# EAGLE design main_schematic (EAGLE 7.5.0)
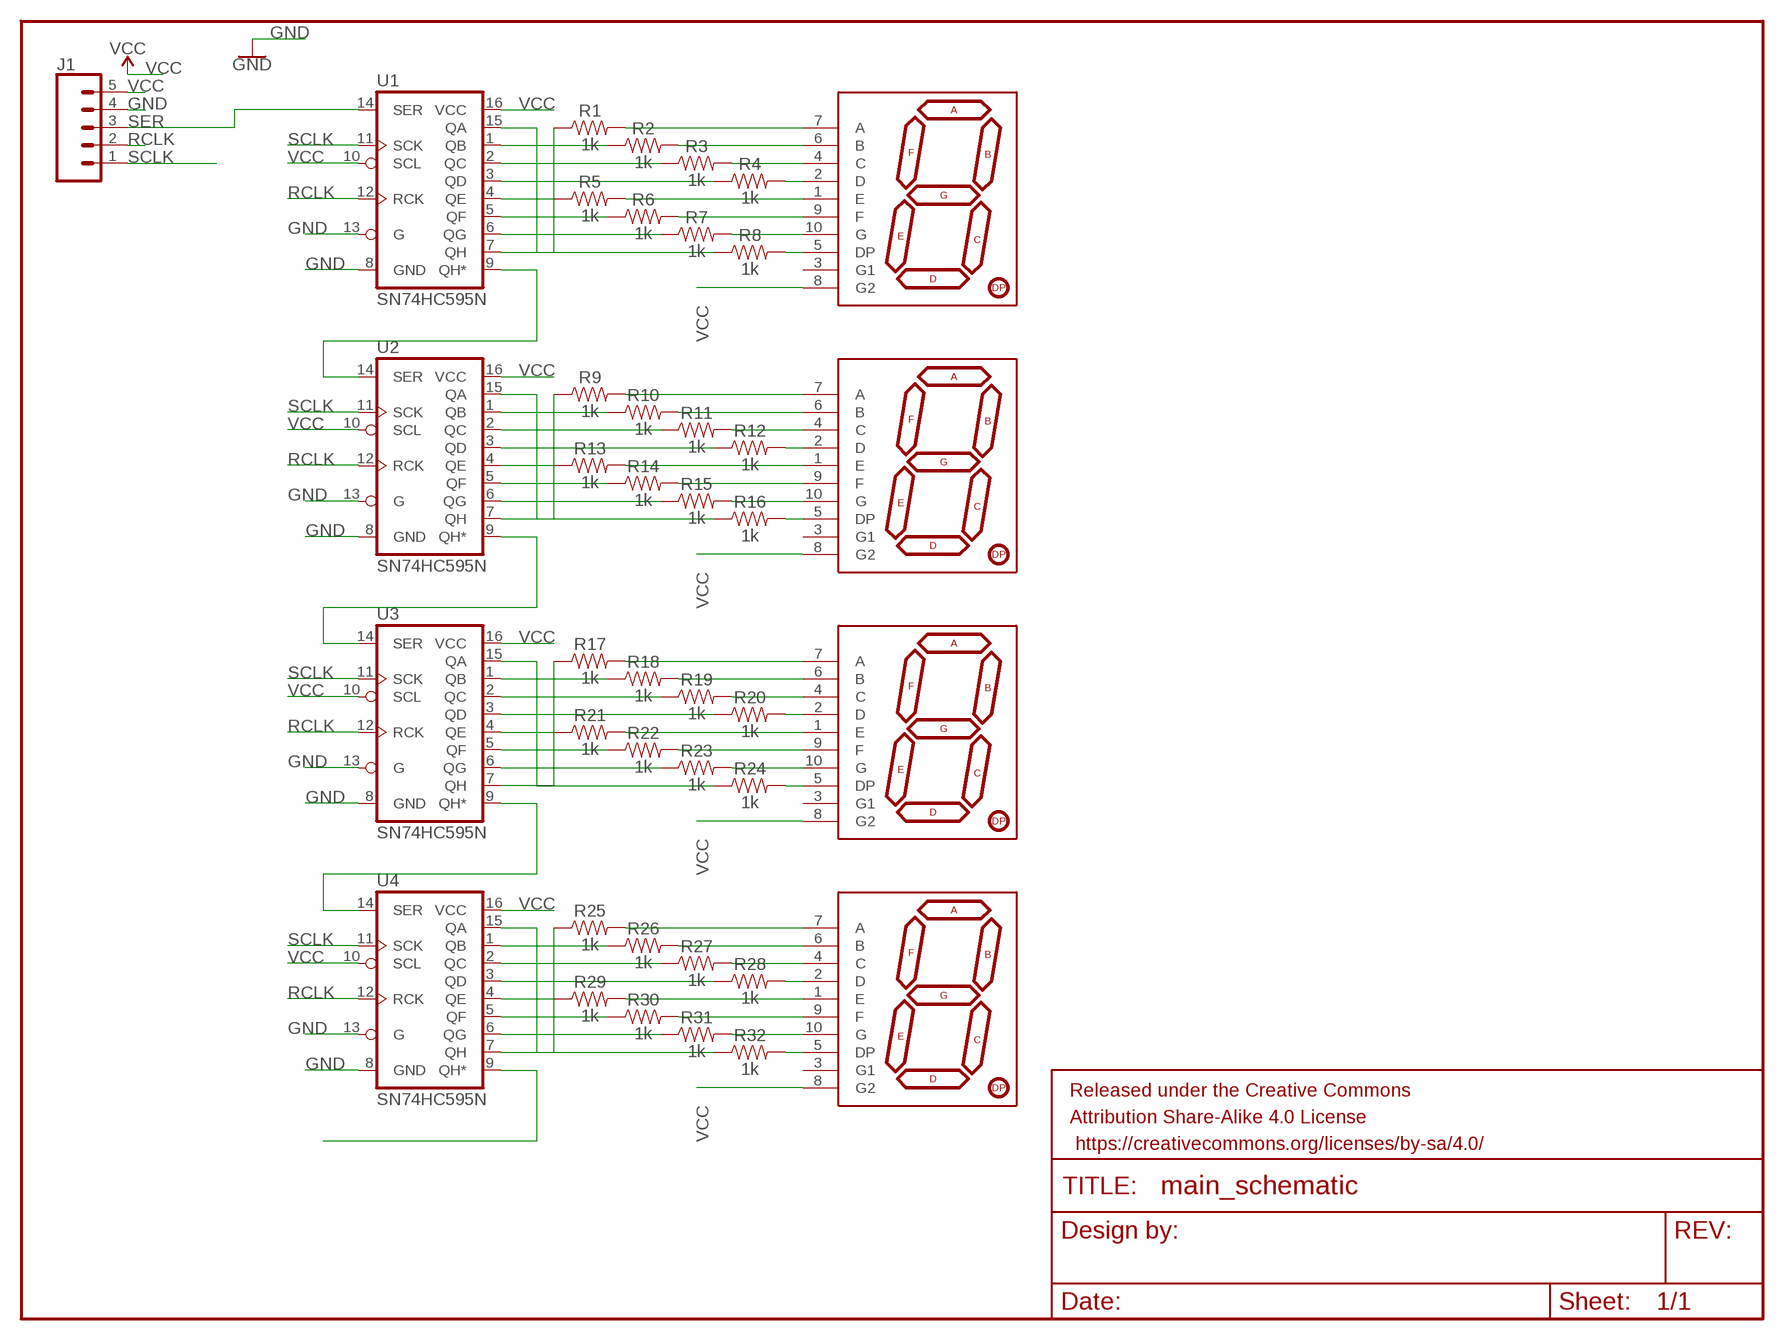
[diagram p0: schematic, sheet 1]

## Parts
FRAME1  FRAME-LETTER  [CREATIVE_COMMONS]
J1  CONN_05  [1X05]
R1  1k  1KOHM-HORIZ_KIT-1/4W-5%  [AXIAL-0.3-KIT]
R2  1k  1KOHM-HORIZ_KIT-1/4W-5%  [AXIAL-0.3-KIT]
R3  1k  1KOHM-HORIZ_KIT-1/4W-5%  [AXIAL-0.3-KIT]
R4  1k  1KOHM-HORIZ_KIT-1/4W-5%  [AXIAL-0.3-KIT]
R5  1k  1KOHM-HORIZ_KIT-1/4W-5%  [AXIAL-0.3-KIT]
R6  1k  1KOHM-HORIZ_KIT-1/4W-5%  [AXIAL-0.3-KIT]
R7  1k  1KOHM-HORIZ_KIT-1/4W-5%  [AXIAL-0.3-KIT]
R8  1k  1KOHM-HORIZ_KIT-1/4W-5%  [AXIAL-0.3-KIT]
R9  1k  1KOHM-HORIZ_KIT-1/4W-5%  [AXIAL-0.3-KIT]
R10  1k  1KOHM-HORIZ_KIT-1/4W-5%  [AXIAL-0.3-KIT]
R11  1k  1KOHM-HORIZ_KIT-1/4W-5%  [AXIAL-0.3-KIT]
R12  1k  1KOHM-HORIZ_KIT-1/4W-5%  [AXIAL-0.3-KIT]
R13  1k  1KOHM-HORIZ_KIT-1/4W-5%  [AXIAL-0.3-KIT]
R14  1k  1KOHM-HORIZ_KIT-1/4W-5%  [AXIAL-0.3-KIT]
R15  1k  1KOHM-HORIZ_KIT-1/4W-5%  [AXIAL-0.3-KIT]
R16  1k  1KOHM-HORIZ_KIT-1/4W-5%  [AXIAL-0.3-KIT]
R17  1k  1KOHM-HORIZ_KIT-1/4W-5%  [AXIAL-0.3-KIT]
R18  1k  1KOHM-HORIZ_KIT-1/4W-5%  [AXIAL-0.3-KIT]
R19  1k  1KOHM-HORIZ_KIT-1/4W-5%  [AXIAL-0.3-KIT]
R20  1k  1KOHM-HORIZ_KIT-1/4W-5%  [AXIAL-0.3-KIT]
R21  1k  1KOHM-HORIZ_KIT-1/4W-5%  [AXIAL-0.3-KIT]
R22  1k  1KOHM-HORIZ_KIT-1/4W-5%  [AXIAL-0.3-KIT]
R23  1k  1KOHM-HORIZ_KIT-1/4W-5%  [AXIAL-0.3-KIT]
R24  1k  1KOHM-HORIZ_KIT-1/4W-5%  [AXIAL-0.3-KIT]
R25  1k  1KOHM-HORIZ_KIT-1/4W-5%  [AXIAL-0.3-KIT]
R26  1k  1KOHM-HORIZ_KIT-1/4W-5%  [AXIAL-0.3-KIT]
R27  1k  1KOHM-HORIZ_KIT-1/4W-5%  [AXIAL-0.3-KIT]
R28  1k  1KOHM-HORIZ_KIT-1/4W-5%  [AXIAL-0.3-KIT]
R29  1k  1KOHM-HORIZ_KIT-1/4W-5%  [AXIAL-0.3-KIT]
R30  1k  1KOHM-HORIZ_KIT-1/4W-5%  [AXIAL-0.3-KIT]
R31  1k  1KOHM-HORIZ_KIT-1/4W-5%  [AXIAL-0.3-KIT]
R32  1k  1KOHM-HORIZ_KIT-1/4W-5%  [AXIAL-0.3-KIT]
U1  SN74HC595N  74HC595N  [DIP16]
U2  SN74HC595N  74HC595N  [DIP16]
U3  SN74HC595N  74HC595N  [DIP16]
U4  SN74HC595N  74HC595N  [DIP16]
U$1  YSD-160AB3C-8  7-SEGMENT-1DIGIT-1INCH-BLUE-EZ  [7-SEGMENT-1"PTH-EZ]
U$2  YSD-160AB3C-8  7-SEGMENT-1DIGIT-1INCH-BLUE-EZ  [7-SEGMENT-1"PTH-EZ]
U$3  YSD-160AB3C-8  7-SEGMENT-1DIGIT-1INCH-BLUE-EZ  [7-SEGMENT-1"PTH-EZ]
U$4  YSD-160AB3C-8  7-SEGMENT-1DIGIT-1INCH-BLUE-EZ  [7-SEGMENT-1"PTH-EZ]

## Nets
GND: J1.4 U1.8(GND) U1.13(G) U2.8(GND) U2.13(G) U3.8(GND) U3.13(G) U4.8(GND) U4.13(G)
N$1: R7.P$1 U1.6(QG)
N$2: R2.P$1 U1.1(QB)
N$3: R8.P$2 U$1.5(DP)
N$4: R3.P$1 U1.2(QC)
N$5: R4.P$1 U1.3(QD)
N$6: R7.P$2 U$1.10(G)
N$7: R6.P$2 U$1.9(F)
N$8: R5.P$2 U$1.1(E)
N$9: R4.P$2 U$1.2(D)
N$10: R3.P$2 U$1.4(C)
N$11: R2.P$2 U$1.6(B)
N$12: R1.P$2 U$1.7(A)
N$13: R5.P$1 U1.4(QE)
N$14: R6.P$1 U1.5(QF)
N$15: R8.P$1 U1.15(QA)
N$16: R1.P$1 U1.7(QH)
N$17: U1.9(QH*) U2.14(SER)
N$18: R16.P$2 U$2.5(DP)
N$19: R15.P$2 U$2.10(G)
N$20: R14.P$2 U$2.9(F)
N$21: R13.P$2 U$2.1(E)
N$22: R12.P$2 U$2.2(D)
N$23: R11.P$2 U$2.4(C)
N$24: R10.P$2 U$2.6(B)
N$25: U2.9(QH*) U3.14(SER)
N$26: R9.P$2 U$2.7(A)
N$27: R10.P$1 U2.1(QB)
N$28: R11.P$1 U2.2(QC)
N$29: R12.P$1 U2.3(QD)
N$30: R13.P$1 U2.4(QE)
N$31: R14.P$1 U2.5(QF)
N$32: R15.P$1 U2.6(QG)
N$33: R9.P$1 U2.7(QH)
N$34: R16.P$1 U2.15(QA)
N$35: R24.P$2 U$3.5(DP)
N$36: R23.P$2 U$3.10(G)
N$37: R22.P$2 U$3.9(F)
N$38: R21.P$2 U$3.1(E)
N$39: R20.P$2 U$3.2(D)
N$40: R19.P$2 U$3.4(C)
N$41: R18.P$2 U$3.6(B)
N$42: U3.9(QH*) U4.14(SER)
N$43: R17.P$2 U$3.7(A)
N$44: R18.P$1 U3.1(QB)
N$45: R19.P$1 U3.2(QC)
N$46: R20.P$1 U3.3(QD)
N$47: R21.P$1 U3.4(QE)
N$48: R22.P$1 U3.5(QF)
N$49: R23.P$1 U3.6(QG)
N$50: R17.P$1 U3.7(QH)
N$51: R24.P$1 U3.15(QA)
N$52: R32.P$2 U$4.5(DP)
N$53: R31.P$2 U$4.10(G)
N$54: R30.P$2 U$4.9(F)
N$55: R29.P$2 U$4.1(E)
N$56: R28.P$2 U$4.2(D)
N$57: R27.P$2 U$4.4(C)
N$58: R26.P$2 U$4.6(B)
N$59: U4.9(QH*)
N$60: R25.P$2 U$4.7(A)
N$61: R26.P$1 U4.1(QB)
N$62: R27.P$1 U4.2(QC)
N$63: R28.P$1 U4.3(QD)
N$64: R29.P$1 U4.4(QE)
N$65: R30.P$1 U4.5(QF)
N$66: R31.P$1 U4.6(QG)
N$67: R25.P$1 U4.7(QH)
N$68: R32.P$1 U4.15(QA)
RCLK: J1.2 U1.12(RCK) U2.12(RCK) U3.12(RCK) U4.12(RCK)
SCLK [via]: J1.1 U1.11(SCK) U2.11(SCK) U3.11(SCK) U4.11(SCK)
SER: J1.3 U1.14(SER)
VCC: J1.5 U1.10(SCL) U1.16(VCC) U2.10(SCL) U2.16(VCC) U3.10(SCL) U3.16(VCC) U4.10(SCL) U4.16(VCC) U$1.8(G2) U$2.8(G2) U$3.8(G2) U$4.8(G2)
Unconnected: U$1.3(G1) U$2.3(G1) U$3.3(G1) U$4.3(G1)

## Library data of the parts
FRAME1 = SparkFun-Aesthetics:FRAME-LETTER: Schematic Frame - Letter Standard 8.5x11 US Letter frame
J1 = SparkFun-Connectors:CONN_05: Multi connection point. Often used as Generic Header-pin footprint for 0.1 inch spaced/style header connections On any of the 0.1 inch spaced packages, you can populate with these: Break Away Headers - Straight <https://www.sparkfun.com/products/116> (PRT-00116) Break Away Male Headers - Right Angle <https://www.sparkfun.com/products/553> (PRT-00553) Female Headers <https://www.sparkfun.com/products/115> (PRT-00115) Break Away Headers - Machine Pin <https://www.sparkfun.com/products/117> (PRT-00117) Break Away Female Headers - Swiss Machine Pin <https://www.sparkfun.com/products/743> (PRT-00743) For SCREWTERMINALS and SPRING TERMINALS visit here: Screw Terimnals on SparkFun.com <https://www.sparkfun.com/search/results?term=Screw+Terminals> (5mm/3.5mm/2.54mm spacing) This device is also useful as a general connection point to wire up your design to another part of your project. Our various solder wires solder well into these plated through hole pads. Hook-Up Wire - Assortment (Stranded, 22 AWG) <https://www.sparkfun.com/products/11375> (PRT-11375) Hook-Up Wire - Assortment (Solid Core, 22 AWG) <https://www.sparkfun.com/products/11367> (PRT-11367) View the entire wire category on our website here <https://www.sparkfun.com/categories/141> Special notes: Molex polarized connector foot print use with SKU : PRT-08231 with associated crimp pins and housings. 1MM SMD Version SKU: PRT-10208
R1-R32 = SparkFun-Resistors:1KOHM: 1kΩ resistor A resistor is a passive two-terminal electrical component that implements electrical resistance as a circuit element. Resistors act to reduce current flow, and, at the same time, act to lower voltage levels within circuits. - Wikipedia; PROD_ID: RES-08380
U1-U4 = SparkFun-IC-Logic:74*595: 8-Bit Shift Register (Serial to Parallel) Datasheet <http://cdn.sparkfun.com/datasheets/BreakoutBoards/MM74HC595.pdf> SparkFun Products SparkFun Shift Register Breakout - 74HC595 <https://www.sparkfun.com/products/10680> (BOB-10680); PROD_ID: IC-13123
U$1-U$4 = SparkFun-LED:7-SEGMENT-1DIGIT-1INCH: 7-Segment Display, single digit, 1" EZ is for kits. Pads are only exposed on the bottom side to help prevent soldering in upside down. Datasheet (Red) <https://cdn.sparkfun.com/datasheets/Components/LED/YSD-160AR4B-8.pdf> Datasheet (Blue) <https://cdn.sparkfun.com/datasheets/Components/LED/YSD-160AB3C-8.pdf> SparkFun Products 7-Segment Display - LED (Red) <https://www.sparkfun.com/products/8546> (COM-08546) 7-Segment Display - LED (Blue) <https://www.sparkfun.com/products/9191> (COM-09191); PROD_ID: COMP-09495

## Net classes
1 via: width 0.025 mm, drill 0.508 mm, clearance 0.025 mm

## Board
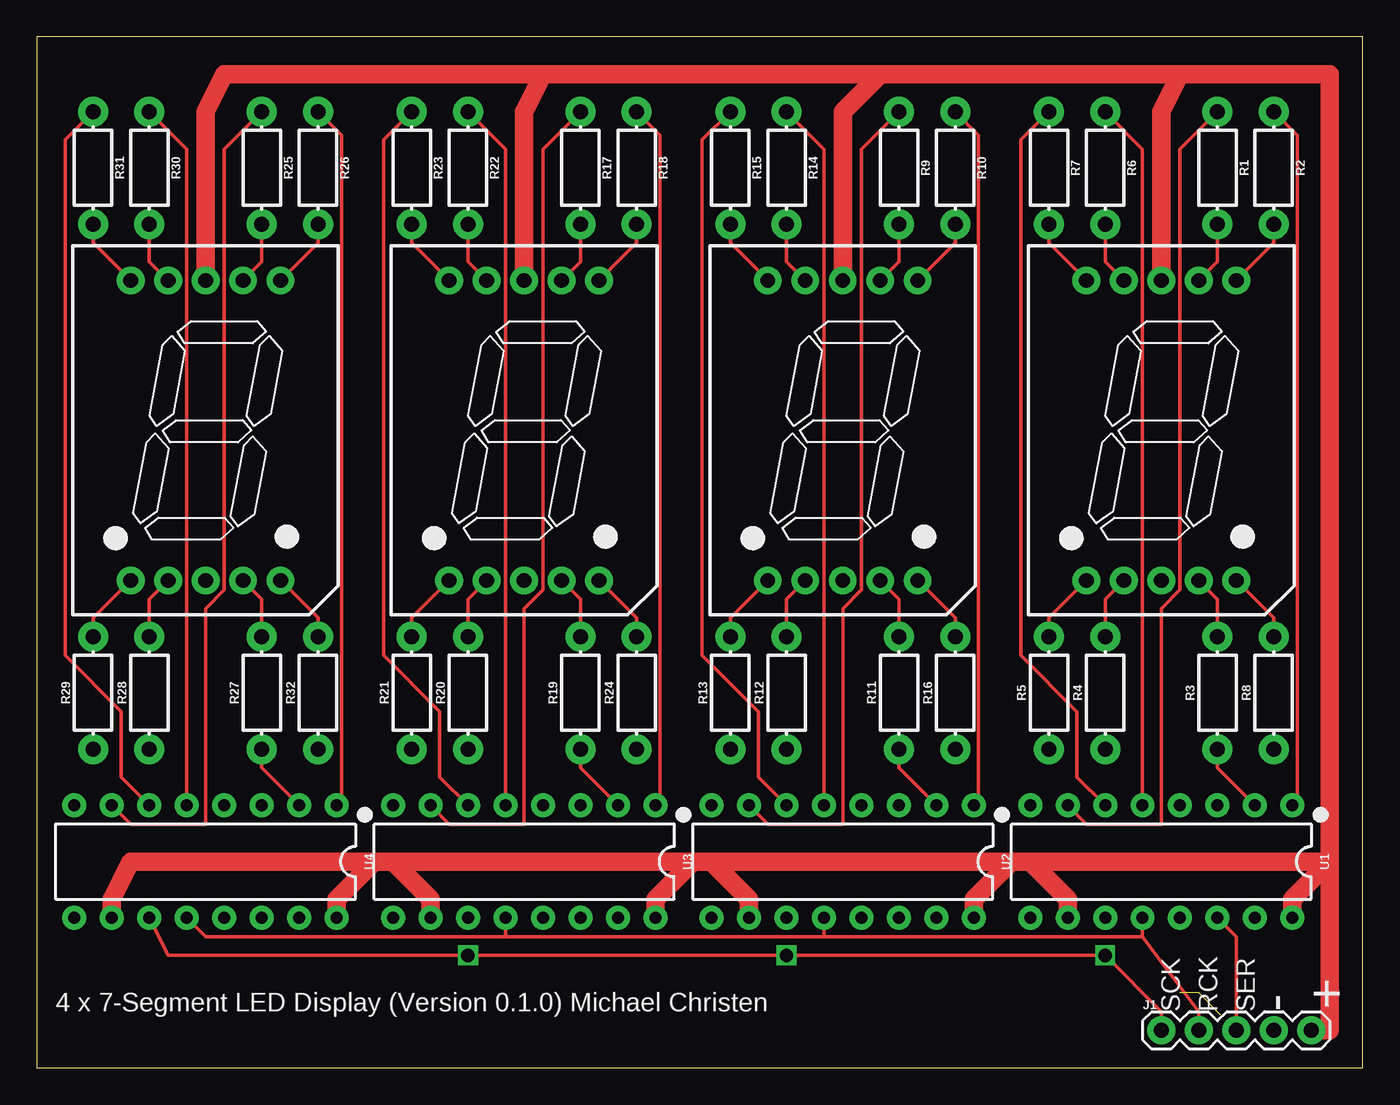
[diagram p1: board, top side]
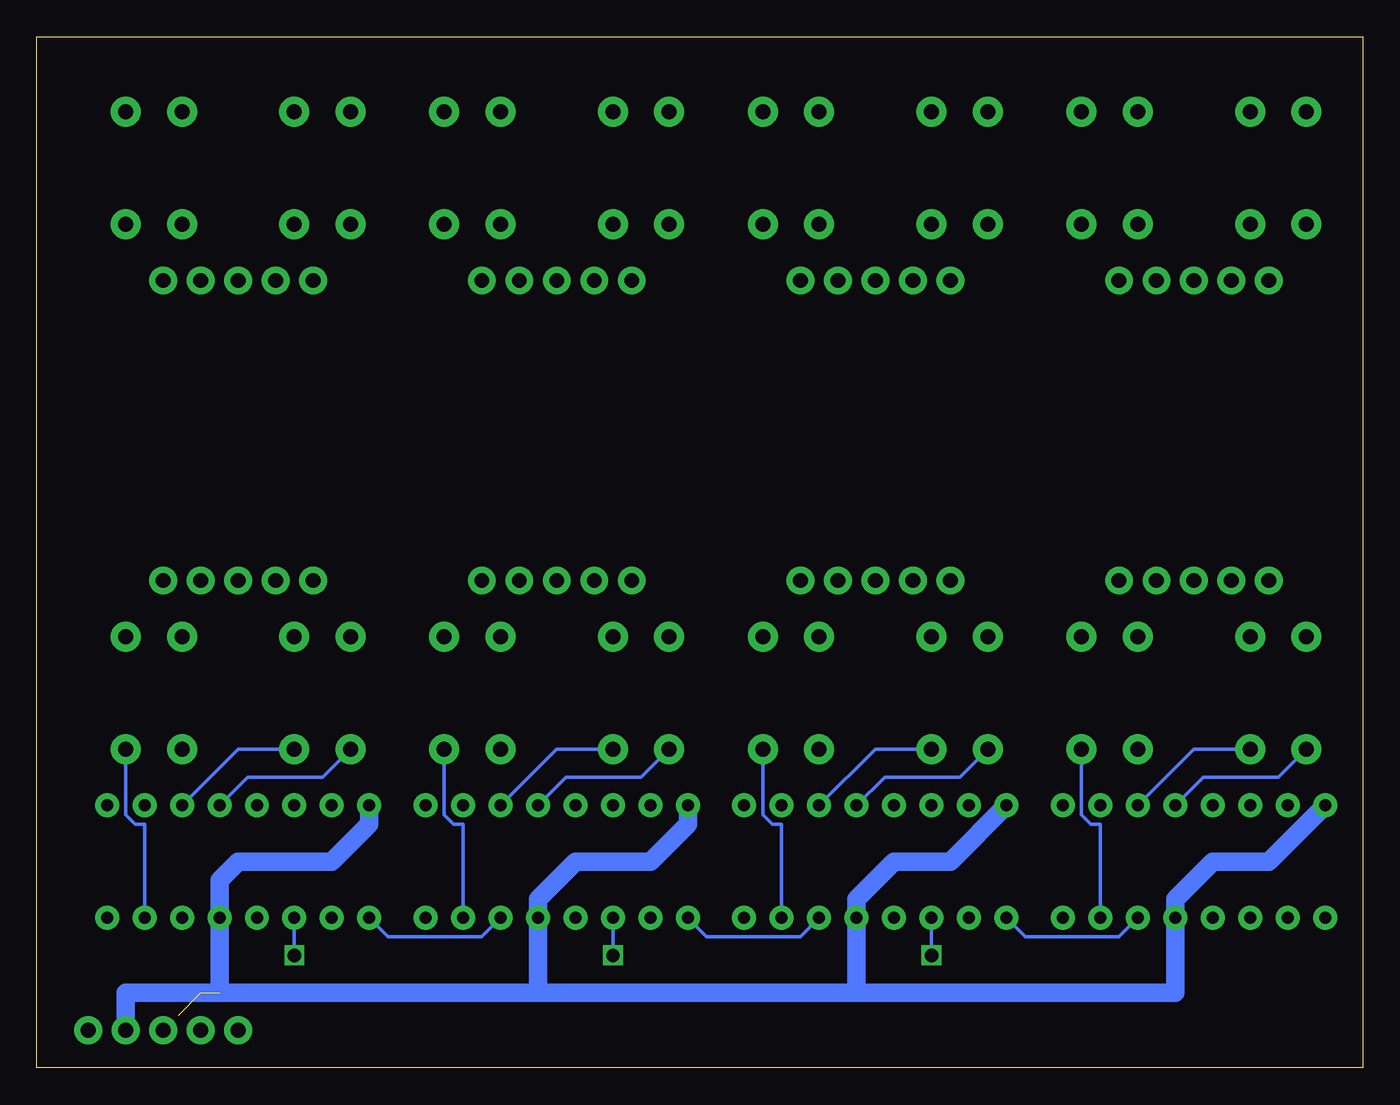
[diagram p2: board, bottom side, seen from below]

Size 89.84 x 69.84 mm. Coordinates in mm from the lower left corner, seen from the top.
Outline: 0,0 89.84,0 89.84,69.84 0,69.84 0,0
Copper layers (1*16): Top 0.035mm / dielectric 1.5mm / Bottom 0.035mm
Design rules "default": minimum track width 10mil, minimum drill 24mil, track to track 8mil, track to pad 8mil, pad to pad 8mil, via to via 8mil, smd to smd 8mil, copper to edge 40mil, drill to drill 8mil, minimum pad ring 10mil, minimum via ring 8mil, stop-mask expansion 4mil, vias tented up to drill 0mil, thermal gap 10mil

### Footprints (pad centres in the part's own frame; a part is rotated, then mirrored left to right if it is on the bottom)
1X05 = drill 1.016 pad 1.88: 1 0,0; 2 2.54,0; 3 5.08,0; 4 7.62,0; 5 10.16,0
AXIAL-0.3-KIT = drill 1.016 pad 2.032: P$1 -3.81,0; P$2 3.81,0
DIP16 = drill 0.813 pad 1.626: 1 -8.89,-3.81; 2 -6.35,-3.81; 3 -3.81,-3.81; 4 -1.27,-3.81; 5 1.27,-3.81; 6 3.81,-3.81; 7 6.35,-3.81; 8 8.89,-3.81; 9 8.89,3.81; 10 6.35,3.81; 11 3.81,3.81; 12 1.27,3.81; 13 -1.27,3.81; 14 -3.81,3.81; 15 -6.35,3.81; 16 -8.89,3.81
7-SEGMENT-1"PTH-EZ = drill 1 pad 1.88: 1 -5.08,-10.16; 2 -2.54,-10.16; 3 0,-10.16; 4 2.54,-10.16; 5 5.08,-10.16; 6 5.08,10.16; 7 2.54,10.16; 8 0,10.16; 9 -2.54,10.16; 10 -5.08,10.16

### Placement (x,y rotation side)
FRAME1  -111.76,-2.54 0 top  (outside the outline)
J1  76.2,2.54 0 top
R1  80.01,60.96 270 top
R2  83.82,60.96 270 top
R3  80.01,25.4 90 top
R4  72.39,25.4 90 top
R5  68.58,25.4 90 top
R6  72.39,60.96 270 top
R7  68.58,60.96 270 top
R8  83.82,25.4 90 top
R9  58.42,60.96 270 top
R10  62.23,60.96 270 top
R11  58.42,25.4 90 top
R12  50.8,25.4 90 top
R13  46.99,25.4 90 top
R14  50.8,60.96 270 top
R15  46.99,60.96 270 top
R16  62.23,25.4 90 top
R17  36.83,60.96 270 top
R18  40.64,60.96 270 top
R19  36.83,25.4 90 top
R20  29.21,25.4 90 top
R21  25.4,25.4 90 top
R22  29.21,60.96 270 top
R23  25.4,60.96 270 top
R24  40.64,25.4 90 top
R25  15.24,60.96 270 top
R26  19.05,60.96 270 top
R27  15.24,25.4 90 top
R28  7.62,25.4 90 top
R29  3.81,25.4 90 top
R30  7.62,60.96 270 top
R31  3.81,60.96 270 top
R32  19.05,25.4 90 top
U1  76.2,13.97 180 top
U2  54.61,13.97 180 top
U3  33.02,13.97 180 top
U4  11.43,13.97 180 top
U$1  76.2,43.18 0 top
U$2  54.61,43.18 0 top
U$3  33.02,43.18 0 top
U$4  11.43,43.18 0 top

### Tracks (layer width: path | path; a pad name or v marks a point on that pad's centre or on a via)
GND  (2 unrouted)
  Bottom 1.27: 77.47,5.08 83.82,5.08 J1.4 | 77.47,5.08 55.88,5.08 | 55.88,5.08 34.29,5.08 | 34.29,5.08 12.7,5.08 U4.13 12.7,11.43 10.16,13.97 6.35,13.97 U4.8 | 34.29,5.08 U3.13 34.29,11.43 31.75,13.97 27.94,13.97 U3.8 | 55.88,5.08 U2.13 55.88,11.43 53.34,13.97 48.26,13.97 45.72,16.51 U2.8 | U1.8 67.31,16.51 69.85,13.97 76.2,13.97 77.47,12.7 U1.13 77.47,5.08
N$1
  Top 0.254: U1.6 70.48,19.68 70.48,24.13 66.67,27.94 66.67,62.87 R7.P$1
N$2
  Top 0.254: U1.1 85.41,18.1 85.41,63.18 R2.P$1
N$3
  Top 0.254: U$1.5 83.82,30.48 R8.P$2
N$4
  Top 0.254: U1.2 80.01,20.32 R3.P$1
N$5
  Bottom 0.254: U1.3 76.2,21.59 R4.P$1
N$6
  Top 0.254: U$1.10 68.58,55.88 R7.P$2
N$7
  Top 0.254: U$1.9 72.39,54.61 R6.P$2
N$8
  Top 0.254: U$1.1 68.58,30.48 R5.P$2
N$9
  Top 0.254: U$1.2 72.39,31.75 R4.P$2
N$10
  Top 0.254: U$1.4 80.01,31.75 R3.P$2
N$11
  Top 0.254: U$1.6 83.82,55.88 R2.P$2
N$12
  Top 0.254: U$1.7 80.01,54.61 R1.P$2
N$13
  Bottom 0.254: U1.4 75.56,19.68 70.48,19.68 R5.P$1
N$14
  Top 0.254: U1.5 74.93,62.23 R6.P$1
N$15
  Bottom 0.254: U1.15 82.55,16.51 83.19,16.51 83.82,17.14 R8.P$1
N$16
  Top 0.254: U1.7 71.12,16.51 76.2,16.51 76.2,31.11 77.47,32.38 77.47,62.23 R1.P$1
N$17
  Bottom 0.254: U1.9 66.04,8.89 59.69,8.89 U2.14
N$18
  Top 0.254: U$2.5 62.23,30.48 R16.P$2
N$19
  Top 0.254: U$2.10 46.99,55.88 R15.P$2
N$20
  Top 0.254: U$2.9 50.8,54.61 R14.P$2
N$21
  Top 0.254: U$2.1 46.99,30.48 R13.P$2
N$22
  Top 0.254: U$2.2 50.8,31.75 R12.P$2
N$23
  Top 0.254: U$2.4 58.42,31.75 R11.P$2
N$24
  Top 0.254: U$2.6 62.23,55.88 R10.P$2
N$25
  Bottom 0.254: U2.9 44.45,8.89 38.1,8.89 U3.14
N$26
  Top 0.254: U$2.7 58.42,54.61 R9.P$2
N$27
  Top 0.254: U2.1 63.82,18.1 63.82,63.18 R10.P$1
N$28
  Top 0.254: U2.2 58.42,20.32 R11.P$1
N$29
  Bottom 0.254: U2.3 54.61,21.59 R12.P$1
N$30
  Bottom 0.254: U2.4 53.98,19.68 48.9,19.68 R13.P$1
N$31
  Top 0.254: U2.5 53.34,62.23 R14.P$1
N$32
  Top 0.254: U2.6 48.9,19.68 48.9,24.13 45.09,27.94 45.09,62.87 R15.P$1
N$33
  Top 0.254: U2.7 49.53,16.51 54.61,16.51 54.61,31.11 55.88,32.38 55.88,62.23 R9.P$1
N$34
  Bottom 0.254: U2.15 60.96,16.51 61.59,16.51 62.23,17.14 R16.P$1
N$35
  Top 0.254: U$3.5 40.64,30.48 R24.P$2
N$36
  Top 0.254: U$3.10 25.4,55.88 R23.P$2
N$37
  Top 0.254: U$3.9 29.21,54.61 R22.P$2
N$38
  Top 0.254: U$3.1 25.4,30.48 R21.P$2
N$39
  Top 0.254: U$3.2 29.21,31.75 R20.P$2
N$40
  Top 0.254: U$3.4 36.83,31.75 R19.P$2
N$41
  Top 0.254: U$3.6 40.64,55.88 R18.P$2
N$42
  Bottom 0.254: U3.9 22.86,8.89 16.51,8.89 U4.14
N$43
  Top 0.254: U$3.7 36.83,54.61 R17.P$2
N$44
  Top 0.254: U3.1 42.23,18.1 42.23,63.18 R18.P$1
N$45
  Top 0.254: U3.2 36.83,20.32 R19.P$1
N$46
  Bottom 0.254: U3.3 33.02,21.59 R20.P$1
N$47
  Bottom 0.254: U3.4 32.38,19.68 27.3,19.68 R21.P$1
N$48
  Top 0.254: U3.5 31.75,62.23 R22.P$1
N$49
  Top 0.254: U3.6 27.3,19.68 27.3,24.13 23.5,27.94 23.5,62.87 R23.P$1
N$50
  Top 0.254: U3.7 27.94,16.51 33.02,16.51 33.02,31.11 34.29,32.38 34.29,62.23 R17.P$1
N$51
  Bottom 0.254: U3.15 39.37,16.51 40.01,16.51 40.64,17.14 R24.P$1
N$52
  Top 0.254: U$4.5 19.05,30.48 R32.P$2
N$53
  Top 0.254: U$4.10 3.81,55.88 R31.P$2
N$54
  Top 0.254: U$4.9 7.62,54.61 R30.P$2
N$55
  Top 0.254: U$4.1 3.81,30.48 R29.P$2
N$56
  Top 0.254: U$4.2 7.62,31.75 R28.P$2
N$57
  Top 0.254: U$4.4 15.24,31.75 R27.P$2
N$58
  Top 0.254: U$4.6 19.05,55.88 R26.P$2
N$60
  Top 0.254: U$4.7 15.24,54.61 R25.P$2
N$61
  Top 0.254: U4.1 20.64,18.1 20.64,63.18 R26.P$1
N$62
  Top 0.254: U4.2 15.24,20.32 R27.P$1
N$63
  Bottom 0.254: U4.3 11.43,21.59 R28.P$1
N$64
  Bottom 0.254: U4.4 10.79,19.68 5.71,19.68 R29.P$1
N$65
  Top 0.254: U4.5 10.16,62.23 R30.P$1
N$66
  Top 0.254: U4.6 5.71,19.68 5.71,24.13 1.91,27.94 1.91,62.87 R31.P$1
N$67
  Top 0.254: U4.7 6.35,16.51 11.43,16.51 11.43,31.11 12.7,32.38 12.7,62.23 R25.P$1
N$68
  Bottom 0.254: U4.15 17.78,16.51 18.41,16.51 19.05,17.14 R32.P$1
RCLK
  Top 0.254: 74.93,8.89 53.34,8.89 | 53.34,8.89 31.75,8.89 | 31.75,8.89 11.43,8.89 U4.12 | U3.12 31.75,8.89 | U2.12 53.34,8.89 | 74.93,8.89 U1.12 | J1.2 78.74,3.81 74.93,8.89
SCLK  (via drill 0.9)
  Top 0.254: U4.11 8.89,7.62 v29.21,7.62 v50.8,7.62 v72.39,7.62 76.2,3.81 J1.1
  Bottom 0.254: U3.11 v29.21,7.62 | U2.11 v50.8,7.62 | U1.11 v72.39,7.62
SER
  Top 0.254: U1.14 81.28,8.89 J1.3
VCC
  Top 1.27: J1.5 87.63,2.54 87.63,13.97 | 87.63,13.97 67.31,13.97 | 67.31,13.97 66.04,13.97 | 66.04,13.97 45.72,13.97 | 45.72,13.97 44.45,13.97 | 44.45,13.97 24.13,13.97 | 24.13,13.97 22.86,13.97 | 22.86,13.97 6.35,13.97 5.08,11.43 U4.10 | U3.10 26.67,11.43 24.13,13.97 | U2.10 48.26,11.43 45.72,13.97 | U1.10 69.85,11.43 67.31,13.97 | U1.16 85.09,11.43 87.63,13.97 | U3.16 41.91,11.43 44.45,13.97 | U4.16 20.32,11.43 22.86,13.97 | U$1.8 76.2,64.77 77.47,67.31 | 77.47,67.31 87.63,67.31 87.63,13.97 | U$2.8 54.61,64.77 57.15,67.31 | 57.15,67.31 77.47,67.31 | U$3.8 33.02,64.77 34.29,67.31 | 34.29,67.31 57.15,67.31 | U$4.8 11.43,64.77 12.7,67.31 34.29,67.31 | U2.16 63.5,11.43 66.04,13.97

### Text on the board
tNames: 4 x 7-Segment LED Display (Version 0.1.0) Michael Christen | SCK | RCK | SER | - | +